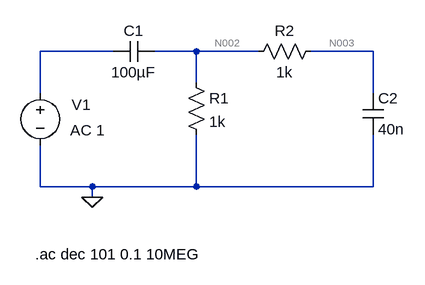
[diagram p0: schematic zad6p.asc]
zad6p.asc, the LTspice schematic file:
Version 4
SHEET 1 880 680
WIRE 48 112 -64 112
WIRE 176 112 112 112
WIRE 272 112 176 112
WIRE 448 112 352 112
WIRE 176 160 176 112
WIRE -64 176 -64 112
WIRE 448 176 448 112
WIRE -64 320 -64 256
WIRE 16 320 -64 320
WIRE 176 320 176 240
WIRE 176 320 16 320
WIRE 448 320 448 240
WIRE 448 320 176 320
WIRE 16 336 16 320
FLAG 16 336 0
SYMBOL voltage -64 160 R0
WINDOW 3 24 44 Invisible 2
WINDOW 123 46 73 Left 2
WINDOW 39 0 0 Left 0
WINDOW 0 48 34 Left 2
SYMATTR Value SINE(0 10 1.59e7 0 0 90)
SYMATTR Value2 AC 1
SYMATTR InstName V1
SYMBOL cap 112 96 R90
WINDOW 0 0 32 VBottom 2
WINDOW 3 32 32 VTop 2
SYMATTR InstName C1
SYMATTR Value 100µF
SYMBOL res 160 144 R0
SYMATTR InstName R1
SYMATTR Value 1k
SYMBOL res 368 96 R90
WINDOW 0 0 56 VBottom 2
WINDOW 3 32 56 VTop 2
SYMATTR InstName R2
SYMATTR Value 1k
SYMBOL cap 432 176 R0
SYMATTR InstName C2
SYMATTR Value 40n
TEXT -72 424 Left 2 !.ac dec 101 0.1 10MEG

The netlist it stands for:
* zad6p.asc
V1 N001 0 SINE(0 10 1.59e7 0 0 90) AC 1
C1 N002 N001 100µF
R1 N002 0 1k
R2 N003 N002 1k
C2 N003 0 40n
.ac dec 101 0.1 10MEG
.backanno
.end

* Results of the author's LTspice run, read from the files saved beside the schematic
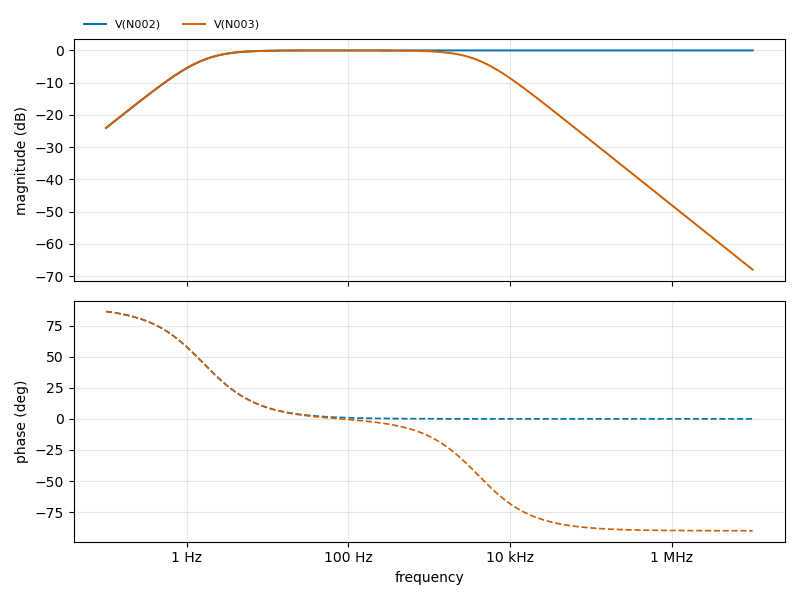
[diagram p1: AC Analysis of zad6p.asc, plotted from the saved traces]
* AC Analysis, 1 run:
*   V(N002): -24.05 dB at 100 mHz, -0.00 dB at 10 MHz, peak -0.00 dB at 10 MHz, 3 dB below the peak at 1.592 Hz
*   V(N003): -24.05 dB at 100 mHz, -68.00 dB at 10 MHz, peak -0.01 dB at 79.61 Hz, 3 dB below the peak at 1.59 Hz and 3.983 kHz